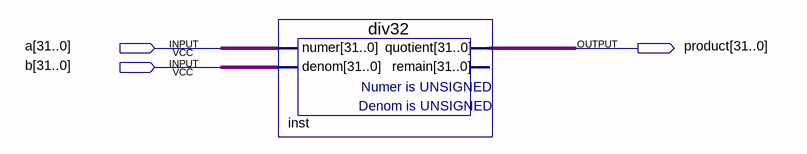
[diagram p0: schematic sheet]
// Quartus schematic multiplier2.bdf as structural Verilog: 1 symbols, 3 pins
module multiplier2 (
  input  [31:0] a,
  input  [31:0] b,
  output [31:0] product
);

  div32 inst (.numer(a), .denom(b), .quotient(product));  // open: remain
endmodule
